# Altium schematic sheet Sheet.SchDoc
size A4
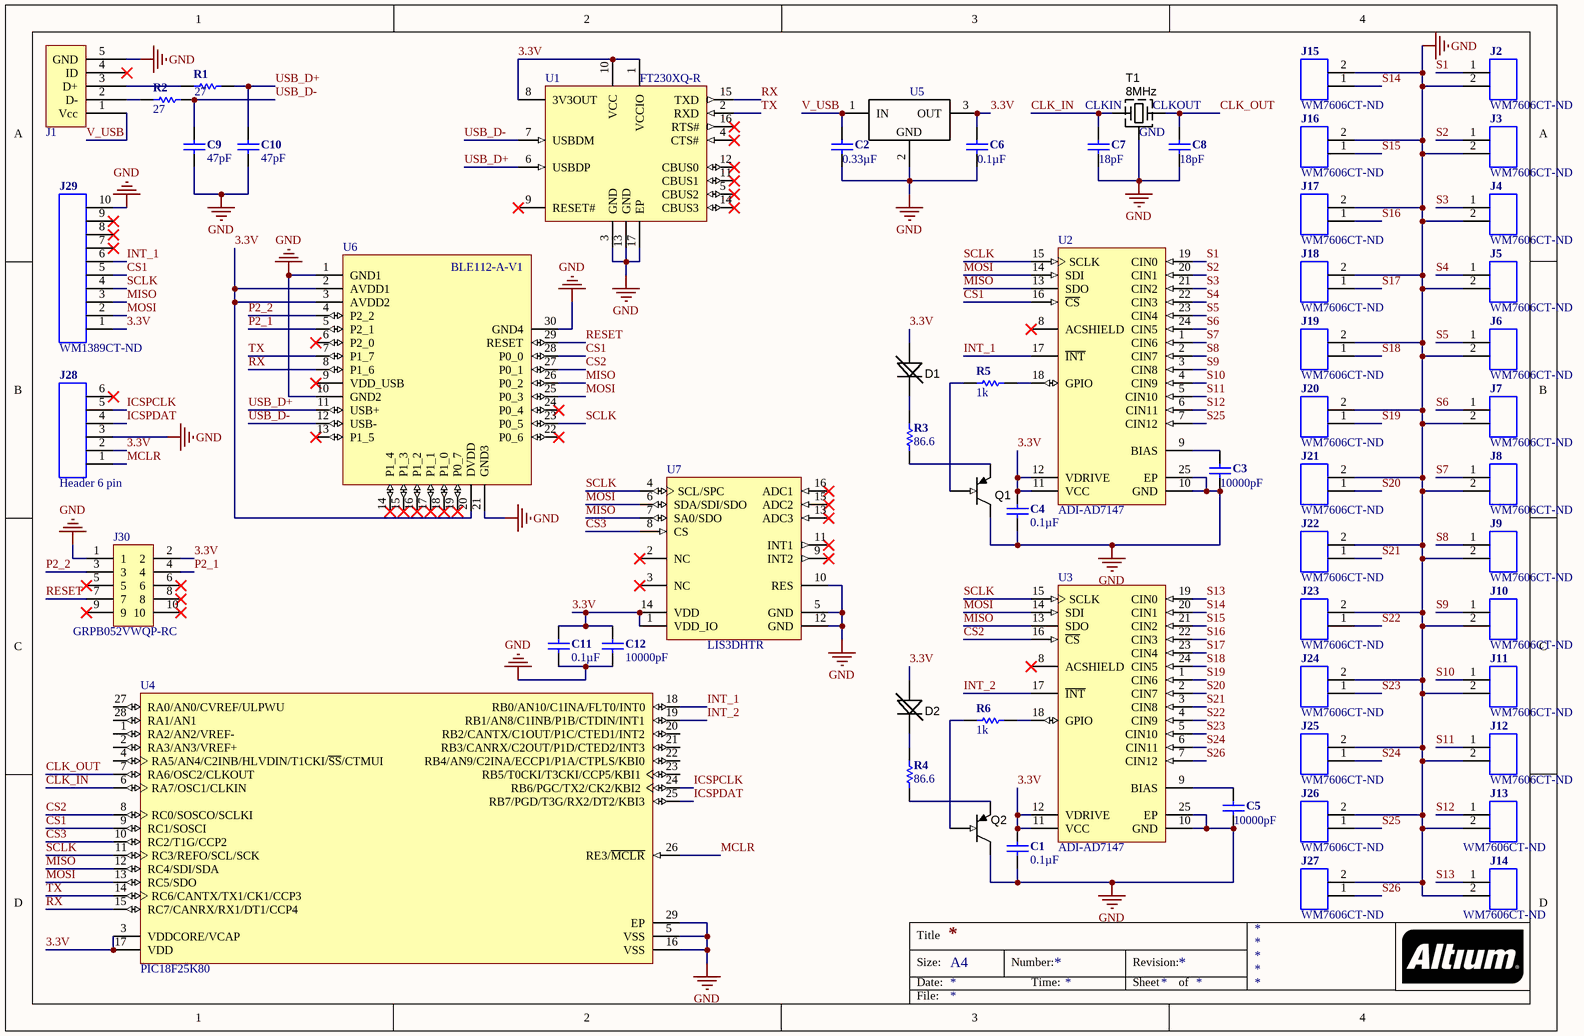
[diagram p0: Sheet.SchDoc]

## Parts
C1  0.1µF  [CAP-0805(2012)-R]
C2  0.33µF  [CAP-0805(2012)-R]
C3  10000pF  [CAP-0805(2012)-R]
C4  0.1µF  [CAP-0805(2012)-R]
C5  10000pF  [CAP-0805(2012)-R]
C6  0.1µF  [CAP-0805(2012)-R]
C7  18pF  [CAP-0805(2012)-R]
C8  18pF  [CAP-0805(2012)-R]
C9  47pF  [CAP-0805(2012)-R]
C10  47pF  [CAP-0805(2012)-R]
C11  0.1µF  [CAP-0805(2012)-R]
C12  10000pF  [CAP-0805(2012)-R]
D1  YELLOW  [LED-0805-A]  (value not drawn)
D2  YELLOW  [LED-0805-A]  (value not drawn)
J1  USB  [USB_Connector_5P_MICRO_USB_FCI]  (value not drawn)
J2  Header 2 pin  [WM7606CT-ND]  (value not drawn)
J3  Header 2 pin  [WM7606CT-ND]  (value not drawn)
J4  Header 2 pin  [WM7606CT-ND]  (value not drawn)
J5  Header 2 pin  [WM7606CT-ND]  (value not drawn)
J6  Header 2 pin  [WM7606CT-ND]  (value not drawn)
J7  Header 2 pin  [WM7606CT-ND]  (value not drawn)
J8  Header 2 pin  [WM7606CT-ND]  (value not drawn)
J9  Header 2 pin  [WM7606CT-ND]  (value not drawn)
J10  Header 2 pin  [WM7606CT-ND]  (value not drawn)
J11  Header 2 pin  [WM7606CT-ND]  (value not drawn)
J12  Header 2 pin  [WM7606CT-ND]  (value not drawn)
J13  Header 2 pin  [WM7606CT-ND]  (value not drawn)
J14  Header 2 pin  [WM7606CT-ND]  (value not drawn)
J15  Header 2 pin  [WM7606CT-ND]  (value not drawn)
J16  Header 2 pin  [WM7606CT-ND]  (value not drawn)
J17  Header 2 pin  [WM7606CT-ND]  (value not drawn)
J18  Header 2 pin  [WM7606CT-ND]  (value not drawn)
J19  Header 2 pin  [WM7606CT-ND]  (value not drawn)
J20  Header 2 pin  [WM7606CT-ND]  (value not drawn)
J21  Header 2 pin  [WM7606CT-ND]  (value not drawn)
J22  Header 2 pin  [WM7606CT-ND]  (value not drawn)
J23  Header 2 pin  [WM7606CT-ND]  (value not drawn)
J24  Header 2 pin  [WM7606CT-ND]  (value not drawn)
J25  Header 2 pin  [WM7606CT-ND]  (value not drawn)
J26  Header 2 pin  [WM7606CT-ND]  (value not drawn)
J27  Header 2 pin  [WM7606CT-ND]  (value not drawn)
J28  Header 6 pin  [HEADER-6-100mil]
J29  Header 10 pin  [MOLEX-503480-1000]  (value not drawn)
J30  GRPB052VWQP-RC  [GRPB052VWQP-RC]
Q1  (no value)  [SOT23-3]
Q2  (no value)  [SOT23-3]
R1  27  [R-0805(2012)-R]
R2  27  [R-0805(2012)-R]
R3  86.6  [R-0805(2012)-R]
R4  86.6  [R-0805(2012)-R]
R5  1k  [R-0805(2012)-R]
R6  1k  [R-0805(2012)-R]
T1  8MHz  [CRYSTAL-8MHZ]
U1  FT230XQ-R  [QFN-16]
U2  ADI-AD7147  [LFCSP_WQ]
U3  ADI-AD7147  [LFCSP_WQ]
U4  PIC18F25K80  [MCHP-QFN-S-MM28_N]
U5  L78L33ACUTR  [SOT89-3]  (value not drawn)
U6  BLE112-A-V1  [BLE112-A-V1]
U7  LIS3DHTR  [STM-LGA-16_N]

## Nets
GND: C1.2 C2.2 C3.2 C4.2 C5.2 C6.2 C7.2 C8.2 C9.1 C10.1 C11.1 C12.1 J1.5(GND) J2.2 J3.2 J4.2 J5.2 J6.2 J7.2 J8.2 J9.2 J10.2 J11.2 J12.2 J13.2 J14.2 J15.2 J16.2 J17.2 J18.2 J19.2 J20.2 J21.2 J22.2 J23.2 J24.2 J25.2 J26.2 J27.2 J28.3 J29.10 J30.1 Q1.2(C) Q2.2(C) T1.2(GND) U1.3(GND) U1.13(GND) U1.17(EP) U2.10(GND) U2.25(EP) U3.10(GND) U3.25(EP) U4.5(VSS) U4.16(VSS) U4.29(EP) U5.2(GND) U6.1(GND1) U6.10(GND2) U6.21(GND3) U6.30(GND4) U7.5(GND) U7.10(RES) U7.12(GND)
3.3V: C1.1 C4.1 C6.1 C11.2 C12.2 D1.A D2.A J28.2 J29.1 J30.2 U1.1(VCCIO) U1.8(3V3OUT) U1.10(VCC) U2.11(VCC) U2.12(VDRIVE) U3.11(VCC) U3.12(VDRIVE) U4.3(VDDCORE/VCAP) U4.17(VDD) U5.3(OUT) U6.2(AVDD1) U6.3(AVDD2) U6.20(DVDD) U7.1(VDD_IO) U7.14(VDD)
CLK_IN: C7.1 T1.1(CLKIN) U4.6(RA7/OSC1/CLKIN)
CLK_OUT: C8.1 T1.3(X) U4.7(RA6/OSC2/CLKOUT)
CS1: J29.5 U2.16(~{CS}) U4.9(RC1/SOSCI) U6.28(P0_0)
CS2: U3.16(~{CS}) U4.8(RC0/SOSCO/SCLKI) U6.27(P0_1)
CS3: U4.10(RC2/T1G/CCP2) U7.8(CS)
ICSPCLK: J28.5 U4.24(RB6/PGC/TX2/CK2/KBI2)
ICSPDAT: J28.4 U4.25(RB7/PGD/T3G/RX2/DT2/KBI3)
INT_1: J29.6 U2.17(~{INT}) U4.18(RB0/AN10/C1INA/FLT0/INT0)
INT_2: U3.17(~{INT}) U4.19(RB1/AN8/C1INB/P1B/CTDIN/INT1)
MCLR: J28.1 U4.26(RE3/~{MCLR})
MISO: J29.3 U2.13(SDO) U3.13(SDO) U4.12(RC4/SDI/SDA) U6.26(P0_2) U7.7(SA0/SDO)
MOSI: J29.2 U2.14(SDI) U3.14(SDI) U4.13(RC5/SDO) U6.25(P0_3) U7.6(SDA/SDI/SDO)
P2_1: J30.4 U6.5(P2_1)
P2_2: J30.3 U6.4(P2_2)
RESET: J30.7 U6.29(RESET)
RX: U1.15(TXD) U4.15(RC7/CANRX/RX1/DT1/CCP4) U6.8(P1_6)
S1: J2.1 U2.19(CIN0)
S2: J3.1 U2.20(CIN1)
S3: J4.1 U2.21(CIN2)
S4: J5.1 U2.22(CIN3)
S5: J6.1 U2.23(CIN4)
S6: J7.1 U2.24(CIN5)
S7: J8.1 U2.1(CIN6)
S8: J9.1 U2.2(CIN7)
S9: J10.1 U2.3(CIN8)
S10: J11.1 U2.4(CIN9)
S11: J12.1 U2.5(CIN10)
S12: J13.1 U2.6(CIN11)
S13: J14.1 U3.19(CIN0)
S14: J15.1 U3.20(CIN1)
S15: J16.1 U3.21(CIN2)
S16: J17.1 U3.22(CIN3)
S17: J18.1 U3.23(CIN4)
S18: J19.1 U3.24(CIN5)
S19: J20.1 U3.1(CIN6)
S20: J21.1 U3.2(CIN7)
S21: J22.1 U3.3(CIN8)
S22: J23.1 U3.4(CIN9)
S23: J24.1 U3.5(CIN10)
S24: J25.1 U3.6(CIN11)
S25: J26.1 U2.7(CIN12)
S26: J27.1 U3.7(CIN12)
SCLK: J29.4 U2.15(SCLK) U3.15(SCLK) U4.11(RC3/REFO/SCL/SCK) U6.23(P0_5) U7.4(SCL/SPC)
TX: U1.2(RXD) U4.14(RC6/CANTX/TX1/CK1/CCP3) U6.7(P1_7)
USB_D+: C10.2 R1.2 U1.6(USBDP) U6.11(USB+)
USB_D-: C9.2 R2.2 U1.7(USBDM) U6.12(USB-)
V_USB: C2.1 J1.1(Vcc) U5.1(IN)
NetC3_1: C3.1 U2.9(BIAS)
NetC5_1: C5.1 U3.9(BIAS)
NetD1_K: D1.K R3.2
NetD2_K: D2.K R4.2
NetJ1_2: J1.2(D-) R2.1
NetJ1_3: J1.3(D+) R1.1
NetQ1_1: Q1.1(B) R5.1
NetQ1_3: Q1.3(E) R3.1
NetQ2_1: Q2.1(B) R6.2
NetQ2_3: Q2.3(E) R4.1
NetR5_2: R5.2 U2.18(GPIO)
NetR6_1: R6.1 U3.18(GPIO)

Not connected (* = marked no-connect by the designer): J1 4(ID)*; J28 6*; J29 7* 8* 9*; J30 5* 6* 8* 9* 10*; U1 4(CTS#)* 5(CBUS2)* 9(RESET#)* 11(CBUS1)* 12(CBUS0)* 14(CBUS3)* 16(RTS#)*; U2 8(ACSHIELD)*; U3 8(ACSHIELD)*; U4 1(RA2/AN2/VREF-) 2(RA3/AN3/VREF+) 4(RA5/AN4/C2INB/HLVDIN/T1CKI/~{SS}/CTMUI) 20(RB2/CANTX/C1OUT/P1C/CTED1/INT2) 21(RB3/CANRX/C2OUT/P1D/CTED2/INT3) 22(RB4/AN9/C2INA/ECCP1/P1A/CTPLS/KBI0) 23(RB5/T0CKI/T3CKI/CCP5/KBI1) 27(RA0/AN0/CVREF/ULPWU) 28(RA1/AN1); U6 6(P2_0)* 9(VDD_USB)* 13(P1_5)* 14(P1_4)* 15(P1_3)* 16(P1_2)* 17(P1_1)* 18(P1_0)* 19(P0_7)* 22(P0_6)* 24(P0_4)*; U7 2(NC)* 3(NC)* 9(INT2)* 11(INT1)* 13(ADC3)* 15(ADC2)* 16(ADC1)*

## Notes on the sheet
- Title
- Size:
- Date:
- A4
- Number:
- Time:
- Revision:
- Sheet
- of
- File:
- (in symbol CRYSTAL_8MHz) CLKOUT

## Library data of the parts
C1 C4 C6 C11 = C-0805(2012): ___ OHM ___ mW 0805(2012) SMD; Manufacturer: Yageo; Manufacturer Part Number: CC0805KRX7R9BB104; Tolerance: ±10%; Voltage - Rated: 50V; Temperature Coefficient: X7R; Supplier 1: Digi-Key; Supplier Part Number 1: 311-1140-1-ND; RoHS: RoHS Compliant; Category: Capacitors; Packaging: Cut Tape (CT); Part Status: Active; Capacitance: 0.1µF; Operating Temperature: -55°C ~ 125°C; Features: -; Ratings: -; Applications: General Purpose; Failure Rate: -; Mounting Type: Surface Mount, MLCC; Package / Case: 0805 (2012 Metric); Size / Dimension: 0.079" L x 0.049" W (2.00mm x 1.25mm); Height - Seated (Max): -; Thickness (Max): 0.033" (0.85mm); Lead Spacing: -; Lead Style: -
  C1 C4: Stock 1: 1673347; Pricing 1: 1=0.1, 10=0.052, 25=0.0376, 50=0.0282, 100=0.023, 250=0.01928, 500=0.01646, 1000=0.01294 (USD); ComponentLink1URL: http://www.yageo.com/documents/recent/UPY-GPHC_X7R_6.3V-to-50V_16.pdf; ComponentLink1Description: http://www.yageo.com/documents/recent/UPY-GPHC_X7R_6.3V-to-50V_16.pdf
  C6: Stock 1: 1673292; Pricing 1: 1=0.1, 10=0.052, 25=0.0376, 50=0.0282, 100=0.023, 250=0.01928, 500=0.01646, 1000=0.01294 (USD); ComponentLink1URL: http://www.yageo.com/documents/recent/UPY-GPHC_X7R_6.3V-to-50V_16.pdf; ComponentLink1Description: http://www.yageo.com/documents/recent/UPY-GPHC_X7R_6.3V-to-50V_16.pdf
  C11: Stock 1: 1402266; Pricing 1: 1=0.1, 10=0.053, 25=0.0388, 50=0.029, 100=0.0237, 250=0.0198, 500=0.0169, 1000=0.01328 (USD); ComponentLink1URL: http://www.yageo.com/documents/recent/UPY-GPHC_X7R_6.3V-to-50V_17.pdf; ComponentLink1Description: http://www.yageo.com/documents/recent/UPY-GPHC_X7R_6.3V-to-50V_17.pdf
C2 = C-0805(2012): ___ OHM ___ mW 0805(2012) SMD; Manufacturer: Yageo; Manufacturer Part Number: CC0805KKX7R7BB334; Tolerance: ±10%; Voltage - Rated: 16V; Temperature Coefficient: X7R; Supplier 1: Digi-Key; Supplier Part Number 1: 311-1882-1-ND; RoHS: RoHS Compliant; Category: Capacitors; Stock 1: 5738; Pricing 1: 1=0.19, 10=0.129, 25=0.0948, 50=0.0776, 100=0.0655, 250=0.05344, 500=0.04482, 1000=0.03965 (USD); Packaging: Cut Tape (CT); Part Status: Active; Capacitance: 0.33µF; Operating Temperature: -55°C ~ 125°C; Features: -; Ratings: -; Applications: General Purpose; Failure Rate: -; Mounting Type: Surface Mount, MLCC; Package / Case: 0805 (2012 Metric); Size / Dimension: 0.079" L x 0.049" W (2.00mm x 1.25mm); Height - Seated (Max): -; Thickness (Max): 0.057" (1.45mm); Lead Spacing: -; Lead Style: -; ComponentLink1URL: http://www.yageo.com/documents/recent/UPY-GPHC_X7R_6.3V-to-50V_16.pdf; ComponentLink1Description: http://www.yageo.com/documents/recent/UPY-GPHC_X7R_6.3V-to-50V_16.pdf
C3 C5 C12 = C-0805(2012): ___ OHM ___ mW 0805(2012) SMD; Manufacturer: Yageo; Manufacturer Part Number: CC0805KRX7R9BB103; Tolerance: ±10%; Voltage - Rated: 50V; Temperature Coefficient: X7R; Supplier 1: Digi-Key; Supplier Part Number 1: 311-1136-1-ND; RoHS: RoHS Compliant; Category: Capacitors; Packaging: Cut Tape (CT); Part Status: Active; Capacitance: 10000pF; Operating Temperature: -55°C ~ 125°C; Features: -; Ratings: -; Applications: General Purpose; Failure Rate: -; Mounting Type: Surface Mount, MLCC; Package / Case: 0805 (2012 Metric); Size / Dimension: 0.079" L x 0.049" W (2.00mm x 1.25mm); Height - Seated (Max): -; Thickness (Max): 0.024" (0.60mm); Lead Spacing: -; Lead Style: -
  C3 C5: Stock 1: 786089; Pricing 1: 1=0.1, 10=0.032, 25=0.0232, 50=0.0174, 100=0.0141, 250=0.01184, 500=0.0101, 1000=0.00794 (USD); ComponentLink1URL: http://www.yageo.com/documents/recent/UPY-GPHC_X7R_6.3V-to-50V_16.pdf; ComponentLink1Description: http://www.yageo.com/documents/recent/UPY-GPHC_X7R_6.3V-to-50V_16.pdf
  C12: Stock 1: 501331; Pricing 1: 1=0.1, 10=0.033, 25=0.0236, 50=0.0178, 100=0.0145, 250=0.01216, 500=0.01036, 1000=0.00814 (USD); ComponentLink1URL: http://www.yageo.com/documents/recent/UPY-GPHC_X7R_6.3V-to-50V_17.pdf; ComponentLink1Description: http://www.yageo.com/documents/recent/UPY-GPHC_X7R_6.3V-to-50V_17.pdf
C7 C8 = C-0805(2012): ___ OHM ___ mW 0805(2012) SMD; Manufacturer: Yageo; Manufacturer Part Number: CC0805JRNPO9BN180; Tolerance: ±5%; Voltage - Rated: 50V; Temperature Coefficient: C0G, NP0; Supplier 1: Digi-Key; Supplier Part Number 1: 311-1102-1-ND; RoHS: RoHS Compliant; Category: Capacitors; Stock 1: 101710; Pricing 1: 1=0.1, 10=0.055, 25=0.0396, 50=0.0298, 100=0.0243, 250=0.02032, 500=0.01734, 1000=0.01363 (USD); Packaging: Cut Tape (CT); Part Status: Active; Capacitance: 18pF; Operating Temperature: -55°C ~ 125°C; Features: -; Ratings: -; Applications: General Purpose; Failure Rate: -; Mounting Type: Surface Mount, MLCC; Package / Case: 0805 (2012 Metric); Size / Dimension: 0.079" L x 0.049" W (2.00mm x 1.25mm); Height - Seated (Max): -; Thickness (Max): 0.024" (0.60mm); Lead Spacing: -; Lead Style: -; ComponentLink1URL: http://www.yageo.com/NewPortal/yageodocoutput?fileName=/pdf/MLCC/UPY-GP_NP0_16V-to-50V_14.pdf; ComponentLink1Description: http://www.yageo.com/NewPortal/yageodocoutput?fileName=/pdf/MLCC/UPY-GP_NP0_16V-to-50V_14.pdf
C9 C10 = C-0805(2012): ___ OHM ___ mW 0805(2012) SMD; Manufacturer: Yageo; Manufacturer Part Number: CC0805JRNPO9BN470; Tolerance: ±5%; Voltage - Rated: 50V; Temperature Coefficient: C0G, NP0; Supplier 1: Digi-Key; Supplier Part Number 1: 311-1107-1-ND; RoHS: RoHS Compliant; Category: Capacitors; Stock 1: 181638; Pricing 1: 1=0.1, 10=0.055, 25=0.0396, 50=0.0298, 100=0.0243, 250=0.02032, 500=0.01734, 1000=0.01363 (USD); Packaging: Cut Tape (CT); Part Status: Active; Capacitance: 47pF; Operating Temperature: -55°C ~ 125°C; Features: -; Ratings: -; Applications: General Purpose; Failure Rate: -; Mounting Type: Surface Mount, MLCC; Package / Case: 0805 (2012 Metric); Size / Dimension: 0.079" L x 0.049" W (2.00mm x 1.25mm); Height - Seated (Max): -; Thickness (Max): 0.024" (0.60mm); Lead Spacing: -; Lead Style: -; ComponentLink1URL: http://www.yageo.com/NewPortal/yageodocoutput?fileName=/pdf/MLCC/UPY-GP_NP0_16V-to-50V_14.pdf; ComponentLink1Description: http://www.yageo.com/NewPortal/yageodocoutput?fileName=/pdf/MLCC/UPY-GP_NP0_16V-to-50V_14.pdf
D1 D2 = LED_0805_YELLOW: LED, 0805 SMD, YELLOW; Manufacturer: OSRAM Opto Semiconductors Inc.; Manufacturer Part Number: LY R976-PS-36; Lens Color: White; Lens Transparency: Diffused; Millicandela Rating: 162.5mcd; Lens Style/Size: Rectangle with Flat Top, 1.30mm x 1.25mm; Voltage - Forward (Vf) (Typ): 2V; Current - Test: 20mA; Viewing Angle: 160°; Wavelength - Dominant: 588nm; Wavelength - Peak: 591nm; Supplier 1: Digi-Key; RoHS: RoHS Compliant; Category: Optoelectronics; Stock 1: 77170; Pricing 1: 1=0.26, 10=0.19, 25=0.1396, 100=0.0998, 250=0.06788, 500=0.0599, 1000=0.04692 (USD); Packaging: Cut Tape (CT); Part Status: Active; Color: Yellow; Mounting Type: Surface Mount; Features: -; Package / Case: 0805 (2012 Metric); Supplier Device Package: 0805; Size / Dimension: 2.00mm L x 1.25mm W; Height (Max): 0.90mm; ComponentLink1URL: http://www.osram-os.com/Graphics/XPic9/00078941_0.pdf; ComponentLink1Description: http://www.osram-os.com/Graphics/XPic9/00078941_0.pdf; Supplier Part Number 1: 475-2560-1-ND
J1 = USB: USB_Connector_5P_MICRO_USB_FCI; Manufacturer: FCI; Manufacturer Part Number: 10118194-0001LF; Connector Type: Micro USB Type B receptacle; Current Rating: 1.8 A; Gender: Female; Mounting Angle: Right; Number of Contacts: 5 Contact; Insulation Resistance: 1000 MOhms; Supplier 1: Mouser; RoHS: RoHS Compliant; Category: USB Connectors; Stock 1: 17001; Pricing 1: 1=0.410, 10=0.396, 100=0.278, 500=0.238, 1200=0.198, 2400=0.181, 4800=0.170, 9600=0.159, 24000=0.153 (USD); Color: Black; Contact Plating: Gold; Operating Temperature Range: - 55 C to + 85 C; Packaging: Reel; Product: Micro USB Type B Connectors; Termination Style: SMD/SMT; Brand: FCI; Contact Material: Copper Alloy; Flammability Rating: UL 94 V-0; Standard: USB 2.0; Standard Pack Qty: 9600; RoHS - Mouser: Y; Minimum Order Quantity: 1; Reeling: True; ComponentLink1URL: http://www.mouser.com/ds/2/154/10118194AC-197217.pdf; ComponentLink1Description: http://www.mouser.com/ds/2/154/10118194AC-197217.pdf; Supplier Part Number 1: 649-10118194-0001LF
J2-J27 = CON-2Pin: Header, 2 pin, .1 pitch; Manufacturer: Molex, LLC; Manufacturer Part Number: 0533980271; Pitch - Mating: 0.049" (1.25mm); Style: Board to Cable/Wire; Shrouding: Shrouded - 3 Wall; Number of Positions: 2; Number of Positions Loaded: All; Material Flammability Rating: UL94 V-0; Supplier 1: Digi-Key; RoHS: RoHS Compliant; Category: Connectors, Interconnects; Stock 1: 38010; Pricing 1: 1=1.07, 10=0.941, 25=0.886, 50=0.849, 100=0.8122, 250=0.73832, 500=0.66448 (USD); Packaging: Cut Tape (CT); Part Status: Active; Connector Type: Header; Contact Type: Male Blade; Number of Rows: 1; Row Spacing - Mating: -; Mounting Type: Surface Mount; Termination: Solder; Fastening Type: Detent Lock; Contact Length - Mating: -; Contact Length - Post: -; Overall Contact Length: -; Insulation Height: 0.185" (4.70mm); Contact Shape: Rectangular; Contact Finish - Mating: Tin; Contact Finish Thickness - Mating: 39µin (1.00µm); Features: Solder Retention; Ingress Protection: -; Insulation Color: Natural; Contact Finish - Post: Tin; Contact Material: Phosphor Bronze; Insulation Material: Polyamide (PA), Nylon; Operating Temperature: -; Current Rating: -; Voltage Rating: -; Mated Stacking Heights: -; Contact Finish Thickness - Post: -; Applications: Automotive, General Purpose, Industrial, Medical; ComponentLink1URL: http://www.molex.com/pdm_docs/sd/533980271_sd.pdf; ComponentLink1Description: http://www.molex.com/pdm_docs/sd/533980271_sd.pdf; Supplier Part Number 1: WM7606CT-ND
J28 = CON-6Pin-100Mil: Header, 6 pin, .1 pitch; Manufacturer: TE Connectivity / AMP; Manufacturer Part Number: 4-103327-6; Current Rating: 3 A; Mounting Angle: Vertical; Number of Positions: 6 Position; Pitch: 2.54 mm; Insulation Resistance: 5000 MOhms; Mating Post Length: 5.84 mm; Supplier 1: Mouser; Category: Headers & Wire Housings; Stock 1: 9402; Pricing 1: 1=0.230, 25=0.226, 50=0.212, 100=0.198 (USD); Contact Plating: Tin; Housing Material: Thermoplastic; Number of Rows: 1 Row; Operating Temperature Range: - 65 C to + 105 C; Product: Headers; Series: AMPMODU MOD II; Termination Style: Through Hole; Type: Breakaway; Brand: TE Connectivity / AMP; Contact Material: Phosphor Bronze; Flammability Rating: UL 94 V-0; Mounting Style: -; Row Spacing: 2.54 mm; Contact Gender: Pin (Male); Standard Pack Qty: 240; Termination Post Length: 3.05 mm; Tradename: AMPMODU; Minimum Order Quantity: 1; Reeling: False; ComponentLink1URL: http://www.mouser.com/ds/2/418/NG_CD_103327_T_baseFilename-749374.pdf; ComponentLink1Description: http://www.mouser.com/ds/2/418/NG_CD_103327_T_baseFilename-749374.pdf; Supplier Part Number 1: 571-4-103327-6
J29 = WM1389CT-ND: Header, 10 pin, .50mm pitch; Manufacturer: Molex, LLC; Manufacturer Part Number: 5034801000; Flat Flex Type: FFC, FPC; Connector/Contact Type: Contacts, Top and Bottom; Number of Positions: 10; Pitch: 0.020" (0.50mm); FFC, FCB Thickness: 0.30mm; Locking Feature: Flip Lock, Backlock; Cable End Type: Straight, Tapered; Actuator Material: Polyamide (PA), Nylon, Glass Filled; Voltage Rating: 50V; Material Flammability Rating: UL94 V-0, UL94 HB; Current Rating: 0.5A; Actuator Color: Black; Supplier 1: Digi-Key; RoHS: RoHS Compliant; Category: Connectors, Interconnects; Stock 1: 7104; Pricing 1: 1=0.93, 10=0.821, 25=0.7728, 50=0.7406, 100=0.7083, 250=0.64396, 500=0.57954, 1000=0.51515 (USD); Packaging: Cut Tape (CT); Part Status: Active; Mounting Type: Surface Mount, Right Angle; Termination: Solder; Height Above Board: 0.039" (1.00mm); Contact Material: Phosphor Bronze; Contact Finish: Gold; Housing Material: Liquid Crystal Polymer (LCP), Glass Filled; Features: Solder Retention; Operating Temperature: -40°C ~ 85°C; Contact Finish Thickness: 3.9µin (0.10µm); Housing Color: White; Mating Cycles: 10; ComponentLink1URL: http://www.molex.com/pdm_docs/sd/5034801000_sd.pdf; ComponentLink1Description: http://www.molex.com/pdm_docs/sd/5034801000_sd.pdf; Supplier Part Number 1: WM1389CT-ND
J30 = GRPB052VWQP-RC: CONN HEADER .050" 10PS DL SMD AU; Manufacturer: Sullins Connector Solutions; Connector Type: Header, Unshrouded; Number of Positions: 10; Number of Positions Loaded: All; Pitch: 0.050" (1.27mm); Supplier 1: Digi-Key; Manufacturer Part Number: GRPB052VWQP-RC; RoHS: RoHS Compliant; Category: Connectors, Interconnects; Stock 1: 16500; Pricing 1: 1=1.3, 10=1.083, 25=1.0024, 50=0.9022, 100=0.802, 250=0.70176, 500=0.6416, 1000=0.58145, 2500=0.5213 (USD); Packaging: Bulk; Contact Type: Male Pin; Number of Rows: 2; Row Spacing: 0.050" (1.27mm); Contact Mating Length: 0.118" (3.00mm); Mounting Type: Surface Mount; Termination: Solder; Fastening Type: -; Features: Board Guide; Contact Finish: Gold; Contact Finish Thickness: Flash; Color: -; ComponentLink1URL: http://www.sullinscorp.com/catalogs/85_PAGE90-91_.050_MALE_HDR_ST_RA_SMT.pdf; ComponentLink1Description: http://www.sullinscorp.com/catalogs/85_PAGE90-91_.050_MALE_HDR_ST_RA_SMT.pdf; Supplier Part Number 1: S9013E-05-ND
Q1 Q2 = FMMT591CT-ND: Transistor PNP; Manufacturer: Diodes Incorporated; Manufacturer Part Number: FMMT591TA; Current - Collector (Ic) (Max): 1A; Voltage - Collector Emitter Breakdown (Max): 60V; Vce Saturation (Max) @ Ib, Ic: 350mV @ 100mA, 1A; Current - Collector Cutoff (Max): 100nA; DC Current Gain (hFE) (Min) @ Ic, Vce: 100 @ 500mA, 5V; Power - Max: 500mW; Frequency - Transition: 150MHz; Supplier 1: Digi-Key; RoHS: RoHS Compliant; Category: Discrete Semiconductor Products; Stock 1: 2485; Pricing 1: 1=0.45, 10=0.363, 100=0.2472, 500=0.1854, 1000=0.13905 (USD); Packaging: Cut Tape (CT); Part Status: Active; Transistor Type: PNP; Operating Temperature: -55°C ~ 150°C (TJ); Mounting Type: Surface Mount; Package / Case: TO-236-3, SC-59, SOT-23-3; Supplier Device Package: SOT-23-3; ComponentLink1URL: http://www.diodes.com/_files/datasheets/FMMT591.pdf; ComponentLink1Description: http://www.diodes.com/_files/datasheets/FMMT591.pdf; Supplier Part Number 1: FMMT591CT-ND
R1 R2 = R-0805(2012): ___ OHM ___ mW 0805(2012) SMD; Manufacturer: Yageo; Manufacturer Part Number: RC0805FR-0727RL; Tolerance: ±1%; Power (Watts): 0.125W, 1/8W; Temperature Coefficient: ±100ppm/°C; Supplier 1: Digi-Key; Supplier Part Number 1: 311-27.0CRCT-ND; RoHS: RoHS Compliant; Category: Resistors; Stock 1: 154931; Pricing 1: 1=0.1, 10=0.019, 25=0.0136, 50=0.0104, 100=0.0077, 250=0.00584, 500=0.00468, 1000=0.00345 (USD); Packaging: Cut Tape (CT); Part Status: Active; Resistance: 27; Composition: Thick Film; Features: Moisture Resistant; Operating Temperature: -55°C ~ 155°C; Package / Case: 0805 (2012 Metric); Supplier Device Package: 0805; Size / Dimension: 0.079" L x 0.049" W (2.00mm x 1.25mm); Height - Seated (Max): 0.024" (0.60mm); Failure Rate: -; ComponentLink1URL: http://www.yageo.com/documents/recent/PYu-RC_Group_51_RoHS_L_6.pdf; ComponentLink1Description: http://www.yageo.com/documents/recent/PYu-RC_Group_51_RoHS_L_6.pdf
R3 R4 = R-0805(2012): ___ OHM ___ mW 0805(2012) SMD; Manufacturer: Yageo; Manufacturer Part Number: RC0805FR-0786R6L; Tolerance: ±1%; Power (Watts): 0.125W, 1/8W; Temperature Coefficient: ±100ppm/°C; Supplier 1: Digi-Key; Supplier Part Number 1: 311-86.6CRCT-ND; RoHS: RoHS Compliant; Category: Resistors; Stock 1: 36256; Pricing 1: 1=0.1, 10=0.019, 25=0.0136, 50=0.0104, 100=0.0077, 250=0.00584, 500=0.00468, 1000=0.00345 (USD); Packaging: Cut Tape (CT); Part Status: Active; Resistance (Ohms): 86.6; Composition: Thick Film; Features: Moisture Resistant; Operating Temperature: -55°C ~ 155°C; Package / Case: 0805 (2012 Metric); Supplier Device Package: 0805; Size / Dimension: 0.079" L x 0.049" W (2.00mm x 1.25mm); Height - Seated (Max): 0.024" (0.60mm); Failure Rate: -; ComponentLink1URL: http://www.yageo.com/documents/recent/PYu-RC_Group_51_RoHS_L_7.pdf; ComponentLink1Description: http://www.yageo.com/documents/recent/PYu-RC_Group_51_RoHS_L_7.pdf
R5 R6 = R-0805(2012): ___ OHM ___ mW 0805(2012) SMD; Manufacturer: Yageo; Manufacturer Part Number: RC0805JR-071KL; Tolerance: ±5%; Power (Watts): 0.125W, 1/8W; Temperature Coefficient: ±100ppm/°C; Supplier 1: Digi-Key; Supplier Part Number 1: 311-1.0KARCT-ND; RoHS: RoHS Compliant; Category: Resistors; Stock 1: 1196040; Pricing 1: 1=0.1, 10=0.016, 25=0.0116, 50=0.009, 100=0.0066, 250=0.00504, 500=0.00404, 1000=0.00297 (USD); Packaging: Cut Tape (CT); Part Status: Active; Resistance (Ohms): 1k; Composition: Thick Film; Features: Moisture Resistant; Operating Temperature: -55°C ~ 155°C; Package / Case: 0805 (2012 Metric); Supplier Device Package: 0805; Size / Dimension: 0.079" L x 0.049" W (2.00mm x 1.25mm); Height - Seated (Max): 0.024" (0.60mm); Failure Rate: -; ComponentLink1URL: http://www.yageo.com/documents/recent/PYu-RC_Group_51_RoHS_L_7.pdf; ComponentLink1Description: http://www.yageo.com/documents/recent/PYu-RC_Group_51_RoHS_L_7.pdf
T1 = CRYSTAL_8MHz: Oscillator Crystal 8MHz 10ppm; Manufacturer: ABRACON; Manufacturer Part Number: ABMM2-8.000MHZ-E2-T; Frequency Stability: 20 PPM; Load Capacitance: 18 pF; Type: Ceramic Low Profile Quartz Crystal; ESR: 72 Ohms; Supplier 1: Mouser; RoHS: RoHS Compliant; Category: Crystals; Stock 1: 13032; Pricing 1: 1=0.930, 10=0.823, 50=0.720, 100=0.650, 200=0.630, 500=0.520, 1000=0.470, 2000=0.460, 5000=0.442 (USD); Frequency: 8 MHz; Height: 1.2 mm; Length: 6 mm; Operating Temperature Range: - 20 C to + 70 C; Package / Case: 6 mm x 3.6 mm; Packaging: Reel; Series: ABMM2; Termination Style: SMD/SMT; Tolerance: 20 PPM; Width: 3.6 mm; Brand: ABRACON; Mounting Style: SMD/SMT; Product Category: SMD Crystals; Standard Pack Qty: 1000; RoHS - Mouser: Y; Minimum Order Quantity: 1; Reeling: True; ComponentLink1URL: http://www.mouser.com/ds/2/3/ABMM2-40161.pdf; ComponentLink1Description: http://www.mouser.com/ds/2/3/ABMM2-40161.pdf; Supplier Part Number 1: 815-ABMM2-8-E2T
U1 = FT230XQ-R: USB to Basic UART Interface Chip, UHCI/OHCI/EHCI Compatible, USB 2.0 Compatible, -40 to +85 degC, 16-Pin QFN, Pb-Free, Tape and Reel; Manufacturer: FTDI; Data Rate: 480 Mb/s, 12 Mb/s; Speed: High-Speed; Interface Type: UART, USB; Operating Supply Current: 6.5 mA to 8.3 mA; Operating Supply Voltage: 2.97 V to 5.5 V; PackagingOptionsScrubbed: FT230XQT; Supplier 1: Mouser; Manufacturer Part Number: FT230XQ-R; RoHS: RoHS Compliant; Category: USB Interface IC; Stock 1: 69254; Pricing 1: 1=2.04, 25=1.97, 100=1.90, 250=1.71, 500=1.54, 1000=1.46, 2500=1.38, 5000=1.38 (USD); Package / Case: QFN-16; Packaging: Reel; Product: USB Bridge Controllers; Series: FT230; Type: Bridge, USB to UART; Brand: FTDI; Mounting Style: SMD/SMT; Maximum Operating Temperature: + 85 C; Standard: USB 2.0; Standard Pack Qty: 5000; Tradename: X-Chip; RoHS - Mouser: Y; Minimum Order Quantity: 1; Reeling: True; ComponentLink1URL: http://www.mouser.com/ds/2/163/DS_FT230X-5395.pdf; ComponentLink1Description: http://www.mouser.com/ds/2/163/DS_FT230X-5395.pdf; Supplier Part Number 1: 895-FT230XQ-R
U5 = L78L33ACUTR: Manufacturer: STMicroelectronics; Regulator Topology: Positive Fixed; Voltage - Output: 3.3V; Current - Output: 100mA; Voltage - Dropout (Typical): 1.7V @ 40mA; Voltage - Input: Up to 30V; Supplier 1: Digi-Key; Manufacturer Part Number: L78L33ACUTR; RoHS: RoHS Compliant; Category: Integrated Circuits (ICs); Stock 1: 46216; Pricing 1: 1=0.43, 10=0.349, 100=0.2373, 500=0.17798, 1000=0.13349 (USD); Packaging: Cut Tape (CT); Part Status: Active; Current - Limit (Min): -; Operating Temperature: 0°C ~ 125°C; Mounting Type: Surface Mount; Package / Case: TO-243AA; Supplier Device Package: SOT-89-3; ComponentLink1URL: http://www.st.com/content/ccc/resource/technical/document/datasheet/15/55/e5/aa/23/5b/43/fd/CD00000446.pdf/files/CD00000446.pdf/jcr:content/translations/en.CD00000446.pdf; ComponentLink1Description: http://www.st.com/content/ccc/resource/technical/document/datasheet/15/55/e5/aa/23/5b/43/fd/CD00000446.pdf/files/CD00000446.pdf/jcr:content/translations/en.CD00000446.pdf; Supplier Part Number 1: 497-1200-1-ND
U6 = BLE112-A-V1: CLASS 2 BLTOOTH 4.0 MODULE; Manufacturer: Silicon Labs; RF Family/Standard: Bluetooth; Protocol: Bluetooth v4.0 Low Energy; Frequency: 2.4GHz; Data Rate: 2Mbps; Power - Output: 3dBm; Sensitivity: -85dBm; Serial Interfaces: SPI, UART; Antenna Type: Integrated, Chip; Memory Size: 256kB Flash, 8kB SRAM; Voltage - Supply: 2 V ~ 3.6 V; Current - Receiving: 25mA; Current - Transmitting: 36mA; Supplier 1: Digi-Key; RoHS: RoHS Compliant; Stock 1: 8978; Pricing 1: 1=15.66, 25=14.2956, 100=12.9341 (USD); Packaging: Cut Tape (CT); Modulation: -; Mounting Type: Surface Mount; Operating Temperature: -40°C ~ 85°C; Package / Case: Module; ComponentLink1URL: http://media.digikey.com/pdf/Data%20Sheets/BlueGiga%20PDFs/BLE112.pdf; ComponentLink1Description: http://media.digikey.com/pdf/Data%20Sheets/BlueGiga%20PDFs/BLE112.pdf; Supplier Part Number 1: 1446-1017-1-ND; Manufacturer Part Number: BLE112-A-V1; Category: RF/IF and RFID
U7 = CMP-0234-00055-3: MEMS Digital Output Motion Sensor Ultra Low-Power High Performance 3-Axes "nano" Accelerometer, 1.71 to 3.6 V, -40 to 85 degC, 16-pin (LGA-16), Pb-Free, Tape and Reel; Manufacturer: STMicroelectronics; Bandwidth: 5 kHz; Interface: I2C, SPI; Current Consumption in Power-Down mode: 0.5 uA; ComponentLink2URL: http://www.st.com/st-web-ui/static/active/en/resource/technical/document/datasheet/CD00274221.pdf; Wide Supply Voltage: 1.71 to 3.6 V; ComponentLink1URL: http://www.st.com/; ComponentLink2Description: Datasheet; Mounting Technology: Surface Mount; Output Type: Digital; DatasheetVersion: Rev. 1; ComponentLink1Description: Manufacturer URL; RoHS: TRUE; ComponentLink3URL: http://www.st.com/st-web-ui/static/active/en/resource/technical/document/datasheet/CD00274221.pdf; PartNumber: LIS3DHTR; ComponentLink3Description: Package Specification; PackageDescription: 16-Pin Land Grid Array, Body 3 x 3 mm, Pitch 0.5 mm; PackageReference: LGA-16; Packing: Tape and Reel; Operating Temperature: -40 to 85 degC